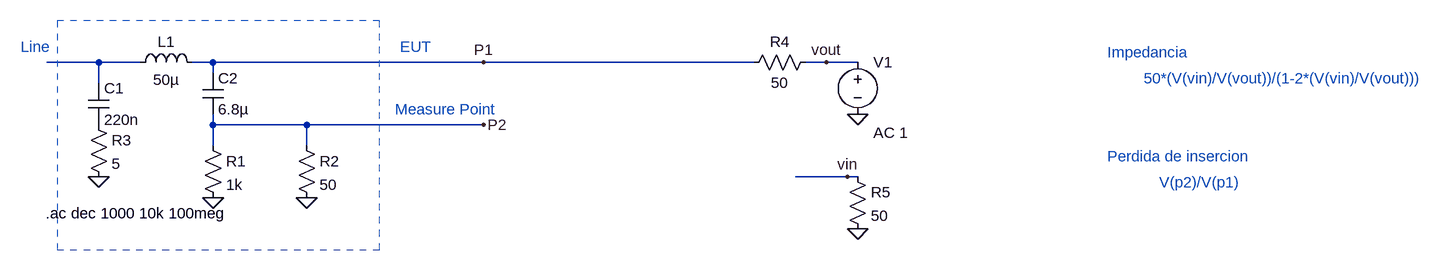
[diagram p0: schematic Com elct.asc]
Com elct.asc, the LTspice schematic file:
Version 4
SHEET 1 2240 680
WIRE 112 80 32 80
WIRE 176 80 112 80
WIRE 288 80 256 80
WIRE 704 80 288 80
WIRE 1120 80 704 80
WIRE 1232 80 1200 80
WIRE 1280 80 1232 80
WIRE 288 96 288 80
WIRE 112 112 112 80
WIRE 288 176 288 160
WIRE 432 176 288 176
WIRE 704 176 432 176
WIRE 288 208 288 176
WIRE 432 208 432 176
WIRE 1264 256 1184 256
WIRE 1280 256 1264 256
FLAG 288 288 0
FLAG 432 288 0
FLAG 1280 160 0
FLAG 112 256 0
FLAG 1280 336 0
FLAG 1232 80 vout
FLAG 1264 256 vin
FLAG 704 176 P2
FLAG 704 80 P1
SYMBOL cap 96 112 R0
SYMATTR InstName C1
SYMATTR Value 220n
SYMBOL ind 160 96 R270
WINDOW 0 32 56 VTop 2
WINDOW 3 5 56 VBottom 2
SYMATTR InstName L1
SYMATTR Value 50µ
SYMBOL cap 272 96 R0
SYMATTR InstName C2
SYMATTR Value 6.8µ
SYMBOL res 272 192 R0
SYMATTR InstName R1
SYMATTR Value 1k
SYMBOL res 416 192 R0
SYMATTR InstName R2
SYMATTR Value 50
SYMBOL res 96 160 R0
SYMATTR InstName R3
SYMATTR Value 5
SYMBOL res 1216 64 R90
WINDOW 0 0 56 VBottom 2
WINDOW 3 32 56 VTop 2
SYMATTR InstName R4
SYMATTR Value 50
SYMBOL res 1264 240 R0
SYMATTR InstName R5
SYMATTR Value 50
SYMBOL voltage 1280 64 R0
WINDOW 123 24 124 Left 2
WINDOW 39 0 0 Left 0
SYMATTR InstName V1
SYMATTR Value ""
SYMATTR Value2 AC 1
TEXT 30 312 Left 2 !.ac dec 1000 10k 100meg
TEXT 1720 104 Left 2 ;50*(V(vin)/V(vout))/(1-2*(V(vin)/V(vout)))
TEXT 1664 64 Left 2 ;Impedancia
TEXT 1664 224 Left 2 ;Perdida de insercion
TEXT 576 56 Left 2 ;EUT
TEXT 568 152 Left 2 ;Measure Point
TEXT -8 56 Left 2 ;Line
TEXT 1744 264 Left 2 ;V(p2)/V(p1)
RECTANGLE Normal 48 368 544 16 2

The netlist it stands for:
* Com elct.asc
C1 N001 P001 220n
L1 N001 P1 50µ
C2 P1 P2 6.8µ
R1 P2 0 1k
R2 P2 0 50
R3 P001 0 5
R4 vout P1 50
R5 vin 0 50
V1 vout 0 AC 1
.ac dec 1000 10k 100meg
* 50*(V(vin)/V(vout))/(1-2*(V(vin)/V(vout)))
* Impedancia
* Perdida de insercion
* EUT
* Measure Point
* Line
* V(p2)/V(p1)
.backanno
.end